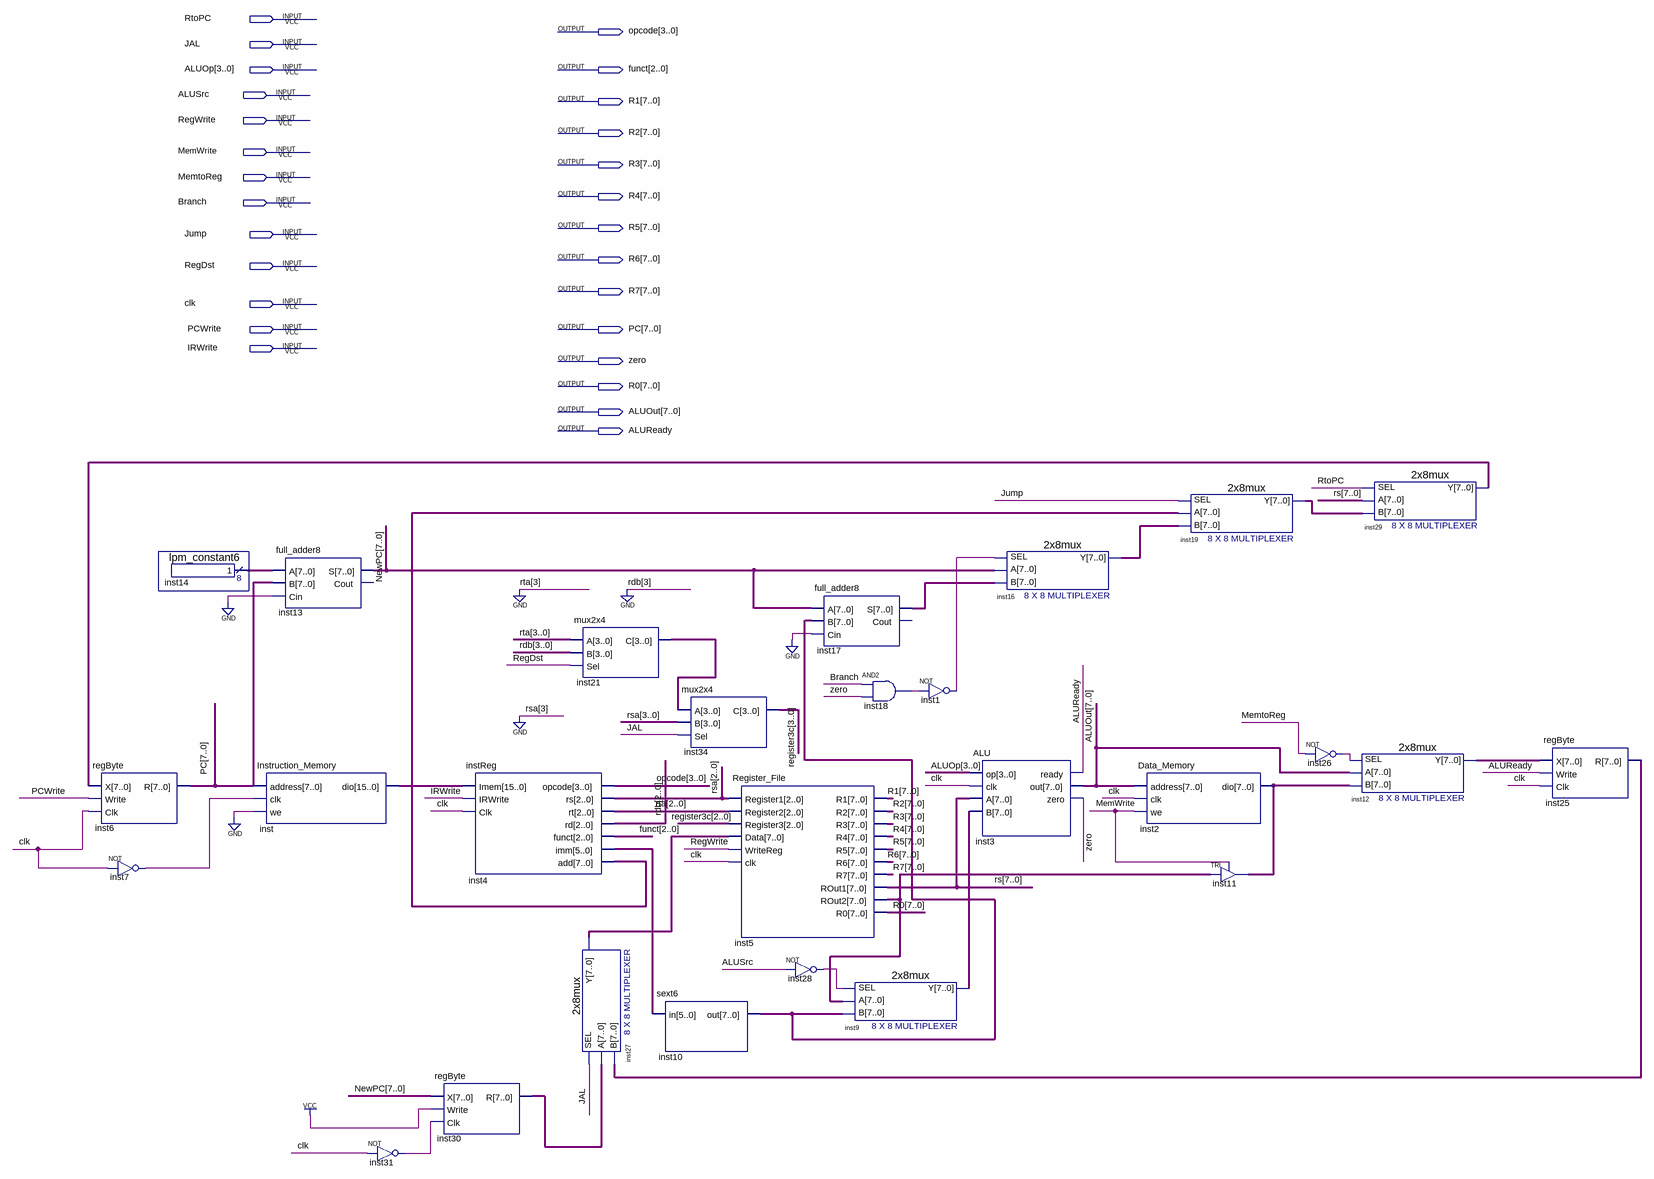
[diagram p0: schematic sheet]
// Quartus schematic Datapath.bdf as structural Verilog: 27 symbols, 27 pins
module Datapath (
  input  RtoPC,
  input  JAL,
  input  [3:0] ALUOp,
  input  ALUSrc,
  input  RegWrite,
  input  MemWrite,
  input  MemtoReg,
  input  Branch,
  input  Jump,
  input  RegDst,
  input  clk,
  input  PCWrite,
  input  IRWrite,
  output [3:0] opcode,
  output [2:0] funct,
  output [7:0] R1,
  output [7:0] R2,
  output [7:0] R3,
  output [7:0] R4,
  output [7:0] R5,
  output [7:0] R6,
  output [7:0] R7,
  output [7:0] PC,
  output zero,
  output [7:0] R0,
  output [7:0] ALUOut,
  output ALUReady
);

  wire inst1_out, inst7_out, inst18_out, inst26_out, inst28_out, inst31_out;
  wire [2:0] rdb, rsa, rta;
  wire [3:0] inst21_c, register3c;
  wire [5:0] inst4_imm;
  wire [7:0] inst2_dio, inst4_add, inst5_rout2, inst9_y, inst10_out, inst12_y, inst14_result, inst16_y,
       inst17_s, inst19_y, inst25_r, inst27_y, inst29_y, inst30_r, NewPC, rs;
  wire [15:0] inst_dio;

  regByte inst6 (.X(inst29_y), .Write(PCWrite), .Clk(clk), .R(PC));
  not inst7 (inst7_out, clk);
  lpm_constant6 inst14 (.result(inst14_result));
  Instruction_Memory inst (.address(PC), .clk(inst7_out), .we(1'b0), .dio(inst_dio));
  full_adder8 inst13 (.A(inst14_result), .B(PC), .Cin(1'b0), .S(NewPC));  // open: Cout
  not inst31 (inst31_out, clk);
  instReg inst4 (
    .Imem(inst_dio), .IRWrite(IRWrite), .Clk(clk), .opcode(opcode), .rs(rsa), .rt(rta), .rd(rdb),
    .funct(funct), .imm(inst4_imm), .add(inst4_add));
  regByte inst30 (.X(NewPC), .Write(1'b1), .Clk(inst31_out), .R(inst30_r));
  mux2x4 inst21 (.A({1'b0, rta}), .B({1'b0, rdb}), .Sel(RegDst), .C(inst21_c));
  \2x8mux  inst27 (.SEL(JAL), .A(inst30_r), .B(inst25_r), .Y(inst27_y));
  sext6 inst10 (.in(inst4_imm), .out(inst10_out));
  mux2x4 inst34 (.A(inst21_c), .B({1'b0, rsa}), .Sel(JAL), .C(register3c));
  Register_File inst5 (
    .Register1(rsa), .Register2(rta), .Register3(register3c[2:0]), .Data(inst27_y), .WriteReg(RegWrite),
    .clk(clk), .R1(R1), .R2(R2), .R3(R3), .R4(R4), .R5(R5), .R6(R6), .R7(R7), .ROut1(rs),
    .ROut2(inst5_rout2), .R0(R0));
  full_adder8 inst17 (.A(NewPC), .B(inst10_out), .Cin(1'b0), .S(inst17_s));  // open: Cout
  not inst28 (inst28_out, ALUSrc);
  and inst18 (inst18_out, Branch, zero);
  \2x8mux  inst9 (.SEL(inst28_out), .A(inst5_rout2), .B(inst10_out), .Y(inst9_y));
  not inst1 (inst1_out, inst18_out);
  ALU inst3 (.op(ALUOp), .clk(clk), .A(rs), .B(inst9_y), .ready(ALUReady), .out(ALUOut), .zero(zero));
  \2x8mux  inst16 (.SEL(inst1_out), .A(NewPC), .B(inst17_s), .Y(inst16_y));
  \2x8mux  inst19 (.SEL(Jump), .A(inst4_add), .B(inst16_y), .Y(inst19_y));
  Data_Memory inst2 (.address(ALUOut), .clk(clk), .we(MemWrite), .dio(inst2_dio));
  TRI inst11[7:0] (.IN(inst5_rout2), .OE(MemWrite), .OUT(inst2_dio));
  not inst26 (inst26_out, MemtoReg);
  \2x8mux  inst29 (.SEL(RtoPC), .A(rs), .B(inst19_y), .Y(inst29_y));
  \2x8mux  inst12 (.SEL(inst26_out), .A(ALUOut), .B(inst2_dio), .Y(inst12_y));
  regByte inst25 (.X(inst12_y), .Write(ALUReady), .Clk(clk), .R(inst25_r));
endmodule
